# EAGLE design untitled (EAGLE 7.2.0)
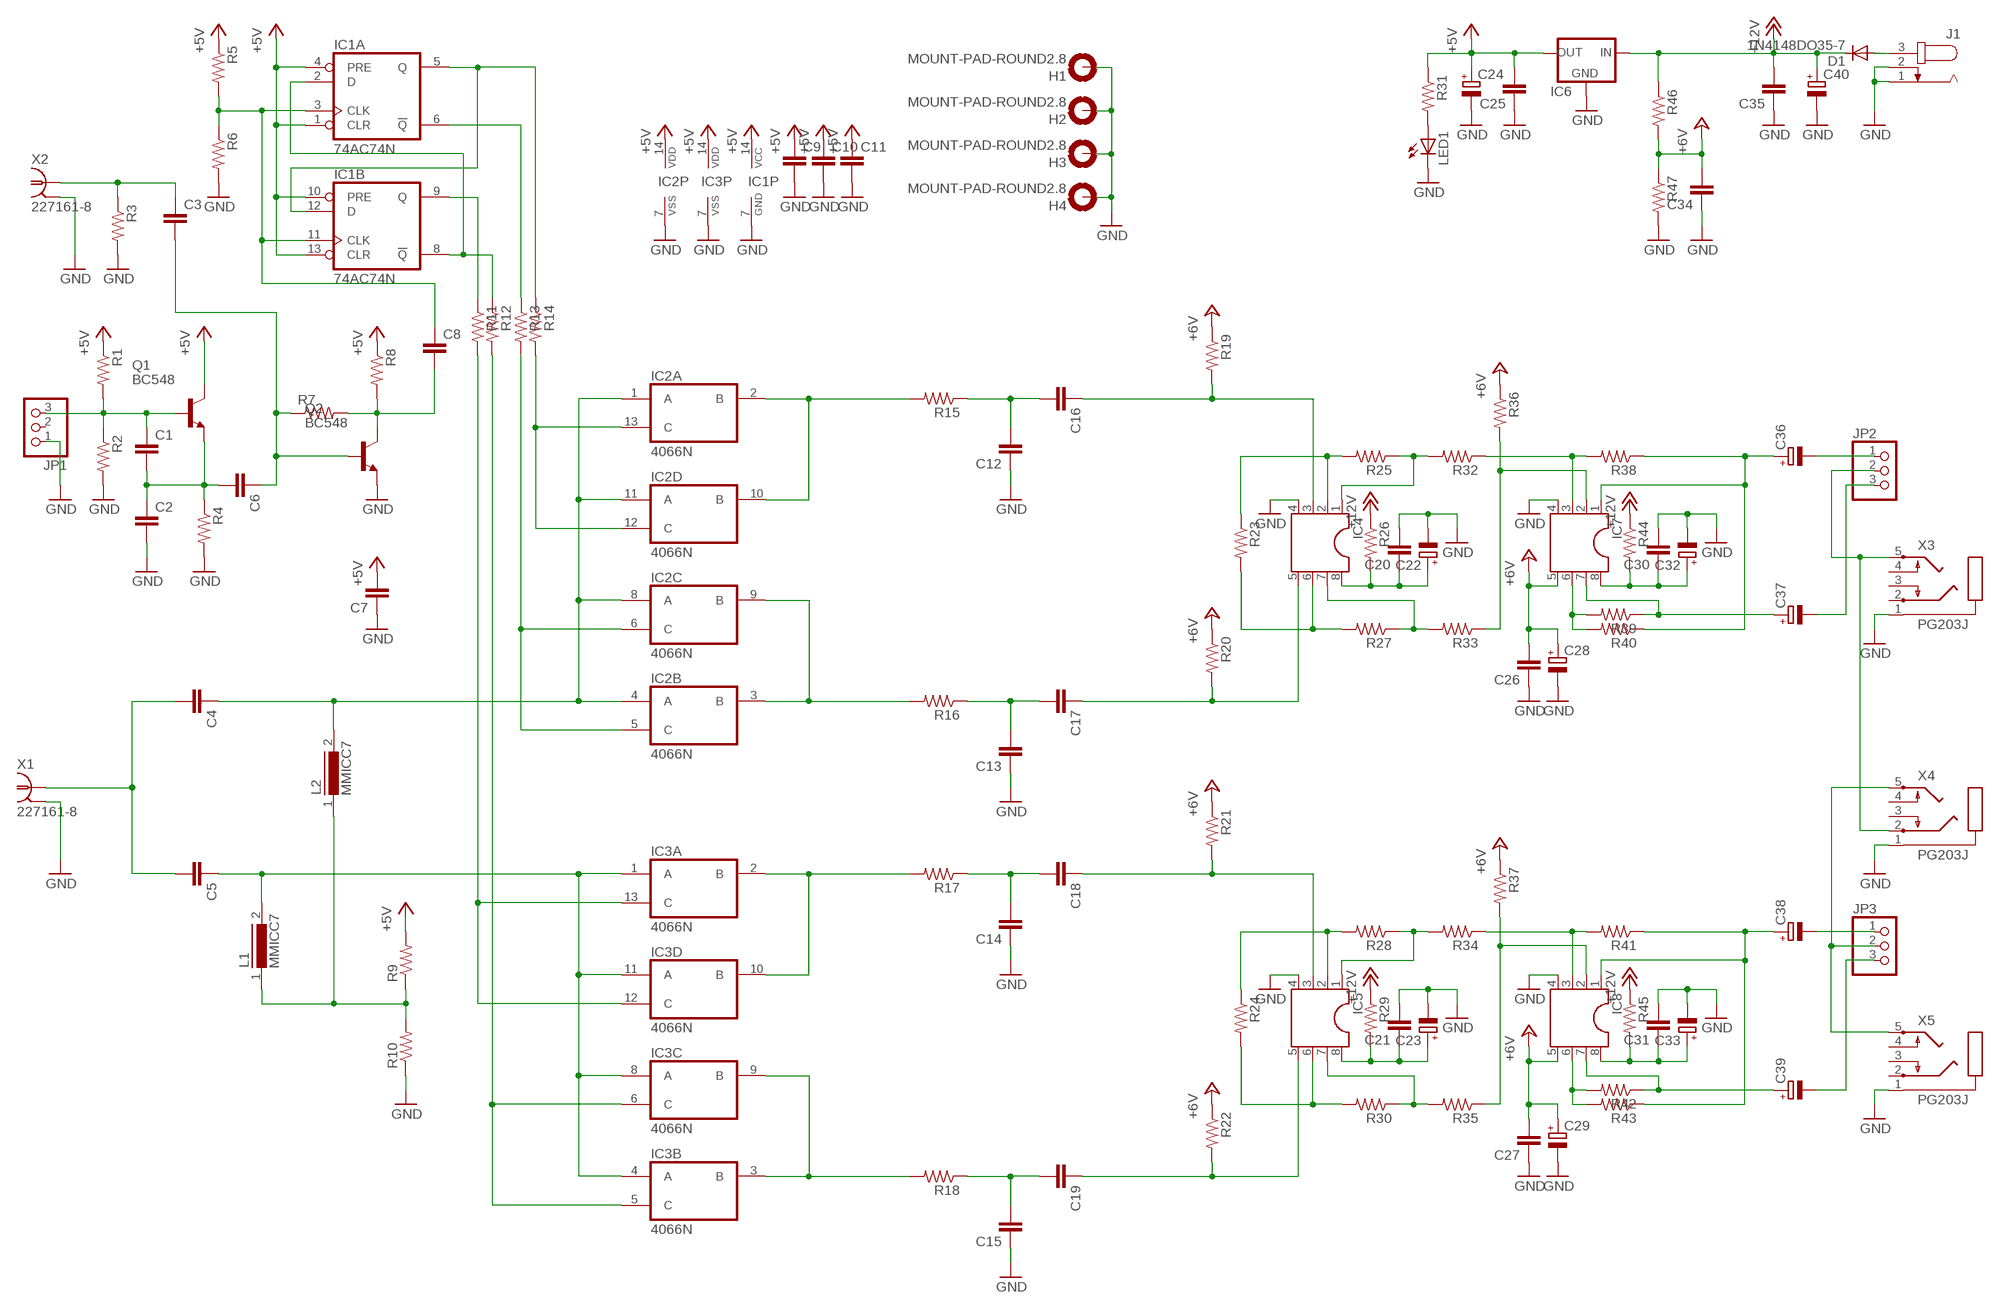
[diagram p0: schematic, sheet 1]

## Parts
C1  C-EU025-025X050  [C025-025X050]
C2  C-EU025-025X050  [C025-025X050]
C3  C-EU050-025X075  [C050-025X075]
C4  C-EU050-025X075  [C050-025X075]
C5  C-EU050-025X075  [C050-025X075]
C6  C-EU050-025X075  [C050-025X075]
C7  C-EU050-025X075  [C050-025X075]
C8  C-EU075-032X103  [C075-032X103]
C9  C-EU050-025X075  [C050-025X075]
C10  C-EU050-025X075  [C050-025X075]
C11  C-EU050-025X075  [C050-025X075]
C12  C-EU050-025X075  [C050-025X075]
C13  C-EU050-025X075  [C050-025X075]
C14  C-EU050-025X075  [C050-025X075]
C15  C-EU050-025X075  [C050-025X075]
C16  C-EU050-025X075  [C050-025X075]
C17  C-EU050-025X075  [C050-025X075]
C18  C-EU050-025X075  [C050-025X075]
C19  C-EU050-025X075  [C050-025X075]
C20  C-EU050-025X075  [C050-025X075]
C21  C-EU050-025X075  [C050-025X075]
C22  CPOL-EUE5-6  [E5-6]
C23  CPOL-EUE5-6  [E5-6]
C24  CPOL-EUE5-6  [E5-6]
C25  C-EU050-025X075  [C050-025X075]
C26  C-EU050-025X075  [C050-025X075]
C27  C-EU050-025X075  [C050-025X075]
C28  CPOL-EUE5-6  [E5-6]
C29  CPOL-EUE5-6  [E5-6]
C30  C-EU050-025X075  [C050-025X075]
C31  C-EU050-025X075  [C050-025X075]
C32  CPOL-EUE5-6  [E5-6]
C33  CPOL-EUE5-6  [E5-6]
C34  C-EU050-025X075  [C050-025X075]
C35  C-EU050-025X075  [C050-025X075]
C36  CPOL-EUE5-6  [E5-6]
C37  CPOL-EUE5-6  [E5-6]
C38  CPOL-EUE5-6  [E5-6]
C39  CPOL-EUE5-6  [E5-6]
C40  CPOL-EUE5-6  [E5-6]
D1  1N4148DO35-7  [DO35-7]
H1  MOUNT-PAD-ROUND2.8  [2,8-PAD]
H2  MOUNT-PAD-ROUND2.8  [2,8-PAD]
H3  MOUNT-PAD-ROUND2.8  [2,8-PAD]
H4  MOUNT-PAD-ROUND2.8  [2,8-PAD]
IC1  74AC74N  [DIL14]
IC2  4066N  [DIL14]
IC3  4066N  [DIL14]
IC4  DIL8  [DIL08]
IC5  DIL8  [DIL08]
IC6  78XXS  [78XXS]
IC7  DIL8  [DIL08]
IC8  DIL8  [DIL08]
J1  JACK-PLUG0  [SPC4077]
JP1  PINHD-1X3  [1X03]
JP2  PINHD-1X3  [1X03]
JP3  PINHD-1X3  [1X03]
L1  MMICC7  [MMICC7]
L2  MMICC7  [MMICC7]
LED1  LED3MM  [LED3MM]
Q1  BC548  [TO92-EBC]
Q2  BC548  [TO92-EBC]
R1  R-US_0207/7  [0207/7]
R2  R-US_0207/7  [0207/7]
R3  R-US_0207/7  [0207/7]
R4  R-US_0207/7  [0207/7]
R5  R-US_0207/7  [0207/7]
R6  R-US_0207/7  [0207/7]
R7  R-US_0207/7  [0207/7]
R8  R-US_0207/7  [0207/7]
R9  R-US_0207/7  [0207/7]
R10  R-US_0207/7  [0207/7]
R11  R-US_0207/7  [0207/7]
R12  R-US_0207/7  [0207/7]
R13  R-US_0207/7  [0207/7]
R14  R-US_0207/7  [0207/7]
R15  R-US_0207/7  [0207/7]
R16  R-US_0207/7  [0207/7]
R17  R-US_0207/7  [0207/7]
R18  R-US_0207/7  [0207/7]
R19  R-US_0207/7  [0207/7]
R20  R-US_0207/7  [0207/7]
R21  R-US_0207/7  [0207/7]
R22  R-US_0207/7  [0207/7]
R23  R-US_0207/7  [0207/7]
R24  R-US_0207/7  [0207/7]
R25  R-US_0207/7  [0207/7]
R26  R-US_0207/7  [0207/7]
R27  R-US_0207/7  [0207/7]
R28  R-US_0207/7  [0207/7]
R29  R-US_0207/7  [0207/7]
R30  R-US_0207/7  [0207/7]
R31  R-US_0207/7  [0207/7]
R32  R-US_0207/7  [0207/7]
R33  R-US_0207/7  [0207/7]
R34  R-US_0207/7  [0207/7]
R35  R-US_0207/7  [0207/7]
R36  R-US_0207/7  [0207/7]
R37  R-US_0207/7  [0207/7]
R38  R-US_0207/7  [0207/7]
R39  R-US_0207/7  [0207/7]
R40  R-US_0207/7  [0207/7]
R41  R-US_0207/7  [0207/7]
R42  R-US_0207/7  [0207/7]
R43  R-US_0207/7  [0207/7]
R44  R-US_0207/7  [0207/7]
R45  R-US_0207/7  [0207/7]
R46  R-US_0207/7  [0207/7]
R47  R-US_0207/7  [0207/7]
X1  227161-8  [AMP_227161]
X2  227161-8  [AMP_227161]
X3  PG203J  [PG203J]
X4  PG203J  [PG203J]
X5  PG203J  [PG203J]

## Nets
+5V: C7.2 C9.1 C10.1 C11.1 C24.+ C25.2 IC1.1(A:CLR) IC1.4(A:PRE) IC1.10(B:PRE) IC1.13(B:CLR) IC1.14(P:VCC) IC2.14(P:VDD) IC3.14(P:VDD) IC6.OUT Q1.C R1.1 R5.1 R8.1 R9.2 R31.1
+12V: C35.2 C40.+ D1.C IC6.IN R26.1 R29.1 R44.1 R45.1 R46.1
+24V: C26.2 C27.2 C28.+ C29.+ C34.2 IC7.5 IC8.5 R19.1 R20.1 R21.1 R22.1 R36.1 R37.1 R46.2 R47.1 ; supply symbol labelled +6V
GND: C2.2 C7.1 C9.2 C10.2 C11.2 C12.1 C13.1 C14.1 C15.1 C20.2 C21.2 C22.- C23.- C24.- C25.1 C26.1 C27.1 C28.- C29.- C30.2 C31.2 C32.- C33.- C34.1 C35.1 C40.- H1.B2,8(MOUNT) H2.B2,8(MOUNT) H3.B2,8(MOUNT) H4.B2,8(MOUNT) IC1.7(P:GND) IC2.7(P:VSS) IC3.7(P:VSS) IC4.4 IC5.4 IC6.GND IC7.4 IC8.4 J1.1 J1.2 JP1.1 LED1.K(C) Q2.E R2.2 R3.2 R4.2 R6.2 R10.1 R47.2 X1.2 X2.2 X3.1 X4.1 X5.1
N$1: L1.1 L2.1 R9.1 R10.2
N$2: C4.2 C5.2 X1.1
N$3: C4.1 IC2.1(A:A) IC2.4(B:A) IC2.8(C:A) IC2.11(D:A) L2.2
N$4: C5.1 IC3.1(A:A) IC3.4(B:A) IC3.8(C:A) IC3.11(D:A) L1.2
N$5: IC2.3(B:B) IC2.9(C:B) R16.2
N$6: IC2.2(A:B) IC2.10(D:B) R15.2
N$7: IC3.2(A:B) IC3.10(D:B) R17.2
N$8: IC3.3(B:B) IC3.9(C:B) R18.2
N$9: IC2.12(D:C) IC2.13(A:C) R14.2
N$10: IC2.5(B:C) IC2.6(C:C) R13.2
N$11: IC3.12(D:C) IC3.13(A:C) R11.2
N$12: IC3.5(B:C) IC3.6(C:C) R12.2
N$13: C12.2 C16.2 R15.1
N$14: C13.2 C17.2 R16.1
N$15: C14.2 C18.2 R17.1
N$16: C15.2 C19.2 R18.1
N$17: IC1.2(A:D) IC1.8(B:!Q) R12.1
N$18: IC1.6(A:!Q) R13.1
N$19: IC1.5(A:Q) IC1.12(B:D) R14.1
N$20: IC1.9(B:Q) R11.1
N$21: C8.1 IC1.3(A:CLK) IC1.11(B:CLK) R5.2 R6.1
N$22: C16.1 IC4.3 R19.2
N$23: C17.1 IC4.5 R20.2
N$24: IC4.2 R23.1 R25.2
N$25: IC4.6 R23.2 R27.2
N$26: IC4.7 R27.1 R33.2
N$27: IC4.1 R25.1 R32.2
N$28: IC7.2 R33.1 R36.2
N$29: C36.+ IC7.1 R38.1 R40.1
N$30: IC7.3 R32.1 R38.2
N$31: IC7.6 R39.2 R40.2
N$32: C37.+ IC7.7 R39.1
N$33: C20.1 C22.+ IC4.8 R26.2
N$34: C30.1 C32.+ IC7.8 R44.2
N$35: D1.A J1.3
N$36: C3.1 R3.1 X2.1
N$37: C36.- JP2.1
N$38: C18.1 IC5.3 R21.2
N$39: C19.1 IC5.5 R22.2
N$40: IC5.2 R24.1 R28.2
N$41: IC5.6 R24.2 R30.2
N$42: IC5.7 R30.1 R35.2
N$43: IC5.1 R28.1 R34.2
N$44: IC8.3 R34.1 R41.2
N$45: IC8.2 R35.1 R37.2
N$46: C38.+ IC8.1 R41.1 R43.1
N$47: IC8.6 R42.2 R43.2
N$48: C39.+ IC8.7 R42.1
N$49: C21.1 C23.+ IC5.8 R29.2
N$50: C31.1 C33.+ IC8.8 R45.2
N$51: C37.- JP2.3
N$52: C38.- JP3.1
N$53: C39.- JP3.3
N$54: C1.1 JP1.3 Q1.B R1.2 R2.1
N$55: C1.2 C2.1 C6.2 Q1.E R4.1
N$56: JP2.2 X3.5 X4.2
N$57: C8.2 Q2.C R7.2 R8.2
N$58: C3.2 C6.1 Q2.B R7.1
N$59: LED1.A R31.2
N$60: JP3.2 X4.5 X5.5
Unconnected: JP1.2 X3.2 X3.3 X3.4 X4.3 X4.4 X5.2 X5.3 X5.4

## Library data of the parts
C1-C21 C25-C27 C30 C31 C34 C35 = rcl:C-EU: CAPACITOR, European symbol
C22-C24 C28 C29 C32 C33 C36-C40 = rcl:CPOL-EU: POLARIZED CAPACITOR, European symbol
D1 = diode:1N4148: DIODE high speed (Philips)
H1-H4 = holes:MOUNT-PAD-ROUND: MOUNTING PAD, round
IC1 = 74xx-eu:74*74: Dual D type positive edge triggered FLIP FLOP, preset and clear
IC2 IC3 = 40xx:4066: Quad bilateral ANALOG SWITCH
IC4 IC5 IC7 IC8 = ic-package:DIL8: Dual In Line / Socket
IC6 = v-reg:78XXS: VOLTAGE REGULATOR
J1 = con-jack:JACK-PLUG: DC POWER JACK Power Jack, DC, Right Angle, Through Hole, Rated 5A at 16VDC, PC Terminals Distributor: Farnell (www.Farnell.de) Drawing: 84N1161.pdf / 84N1162.pdf Manufacturer: SPC Technology (www.spctechnology.com) Type: SPC4077 / SPC 4078; OC_FARNELL: unknown; OC_NEWARK: unknown
JP1-JP3 = pinhead:PINHD-1X3: PIN HEADER
L1 L2 = inductors:MMICC7: INDUCTOR
LED1 = led:LED: LED OSRAM: - CHIPLED LG R971, LG N971, LY N971, LG Q971, LY Q971, LO R971, LY R971 LH N974, LH R974 LS Q976, LO Q976, LY Q976 LO Q996 - Hyper CHIPLED LW Q18S LB Q993, LB Q99A, LB R99A - SideLED LS A670, LO A670, LY A670, LG A670, LP A670 LB A673, LV A673, LT A673, LW A673 LH A674 LY A675 LS A676, LA A676, LO A676, LY A676, LW A676 LS A679, LY A679, LG A679 - Hyper Micro SIDELED® LS Y876, LA Y876, LO Y876, LY Y876 LT Y87S - SmartLED LW L88C, LW L88S LB L89C, LB L89S, LG L890 LS L89K, LO L89K, LY L89K LS L896, LA L896, LO L896, LY L896 - TOPLED LS T670, LO T670, LY T670, LG T670, LP T670 LSG T670, LSP T670, LSY T670, LOP T670, LYG T670 LG T671, LOG T671, LSG T671 LB T673, LV T673, LT T673, LW T673 LH T674 LS T676, LA T676, LO T676, LY T676, LB T676, LH T676, LSB T676, LW T676 LB T67C, LV T67C, LT T67C, LS T67K, LO T67K, LY T67K, LW E67C LS E67B, LA E67B, LO E67B, LY E67B, LB E67C, LV E67C, LT E67C LW T67C LS T679, LY T679, LG T679 LS T770, LO T770, LY T770, LG T770, LP T770 LB T773, LV T773, LT T773, LW T773 LH T774 LS E675, LA E675, LY E675, LS T675 LS T776, LA T776, LO T776, LY T776, LB T776 LHGB T686 LT T68C, LB T68C - Hyper Mini TOPLED® LB M676 - Mini TOPLED Santana® LG M470 LS M47K, LO M47K, LY M47K Source: http://www.osram.convergy.de LUXEON: - LUMILED® LXK2-PW12-R00, LXK2-PW12-S00, LXK2-PW14-U00, LXK2-PW14-V00 LXK2-PM12-R00, LXK2-PM12-S00, LXK2-PM14-U00 LXK2-PE12-Q00, LXK2-PE12-R00, LXK2-PE12-S00, LXK2-PE14-T00, LXK2-PE14-U00 LXK2-PB12-K00, LXK2-PB12-L00, LXK2-PB12-M00, LXK2-PB14-N00, LXK2-PB14-P00, LXK2-PB14-Q00 LXK2-PR12-L00, LXK2-PR12-M00, LXK2-PR14-Q00, LXK2-PR14-R00 LXK2-PD12-Q00, LXK2-PD12-R00, LXK2-PD12-S00 LXK2-PH12-R00, LXK2-PH12-S00 LXK2-PL12-P00, LXK2-PL12-Q00, LXK2-PL12-R00 Source: www.luxeon.com KINGBRIGHT: KA-3528ASYC Source: www.kingbright.com
Q1 Q2 = transistor-npn:BC548*: NPN Transistor
R1-R47 = rcl:R-US_: RESISTOR, American symbol
X1 X2 = con-coax:?227161*: JACK, RIGHT ANGLE, 50 OHM, PCB, BNC Source: amp_227161.pdf; OC_FARNELL: unknown; OC_NEWARK: unknown
X3-X5 = con-hirschmann:PG203J: MIC/HEADPHONE JACK KS-S stereo microphone/headphone jack PG203JN (Schukat); OC_FARNELL: unknown; OC_NEWARK: unknown

## Board
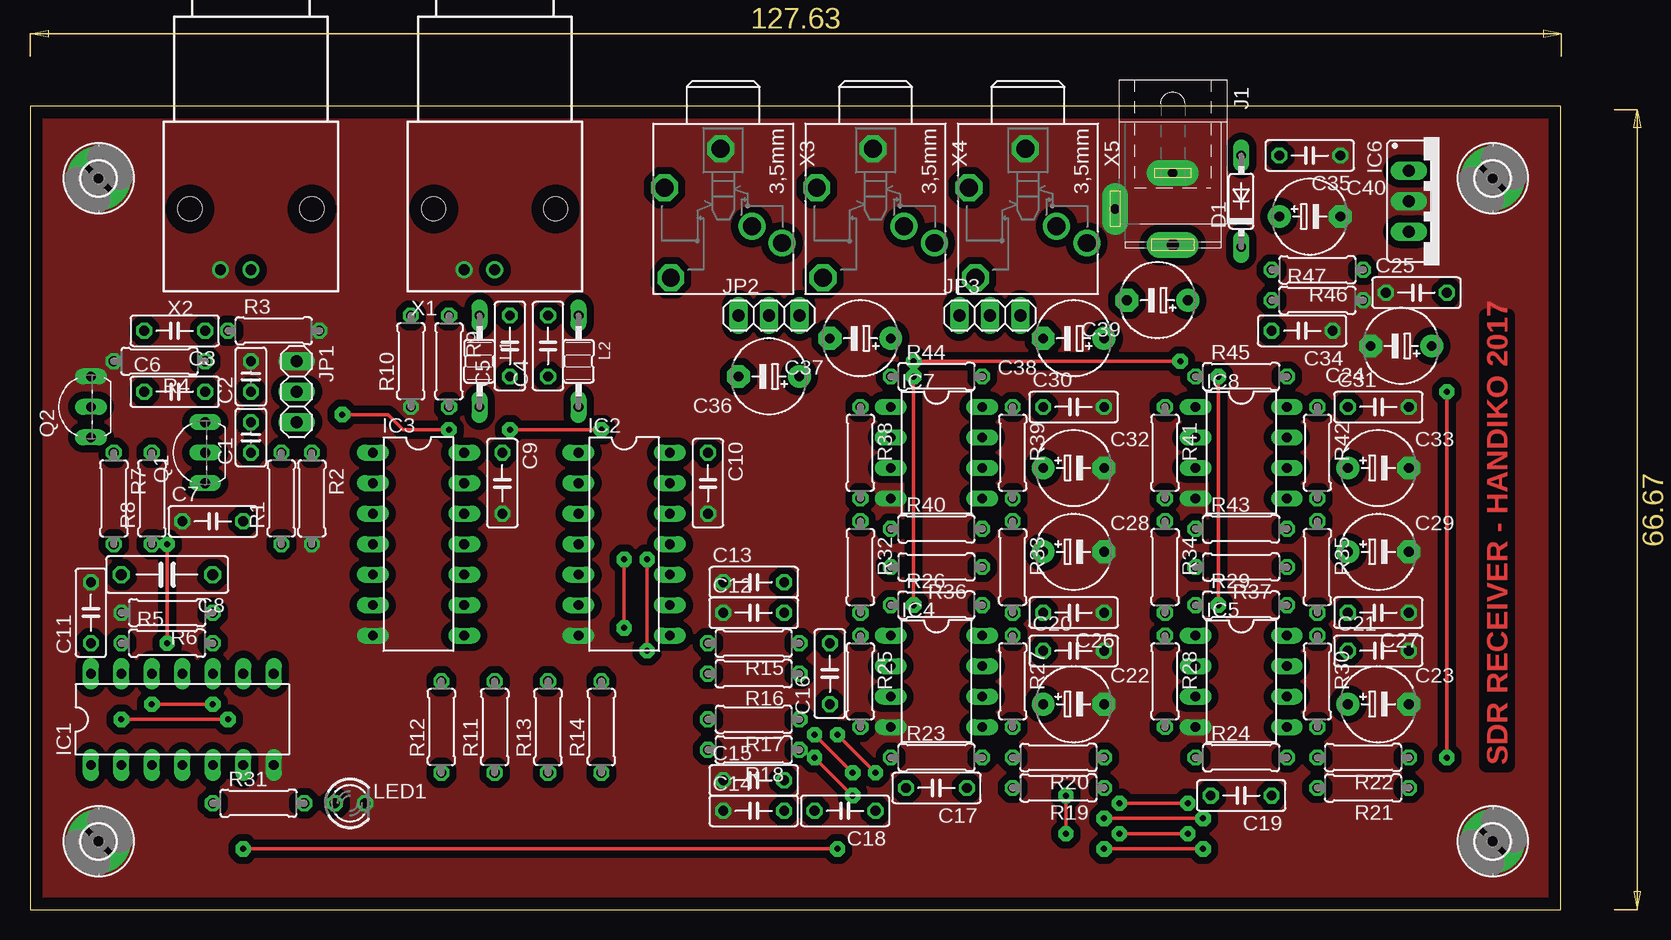
[diagram p1: board, top side]
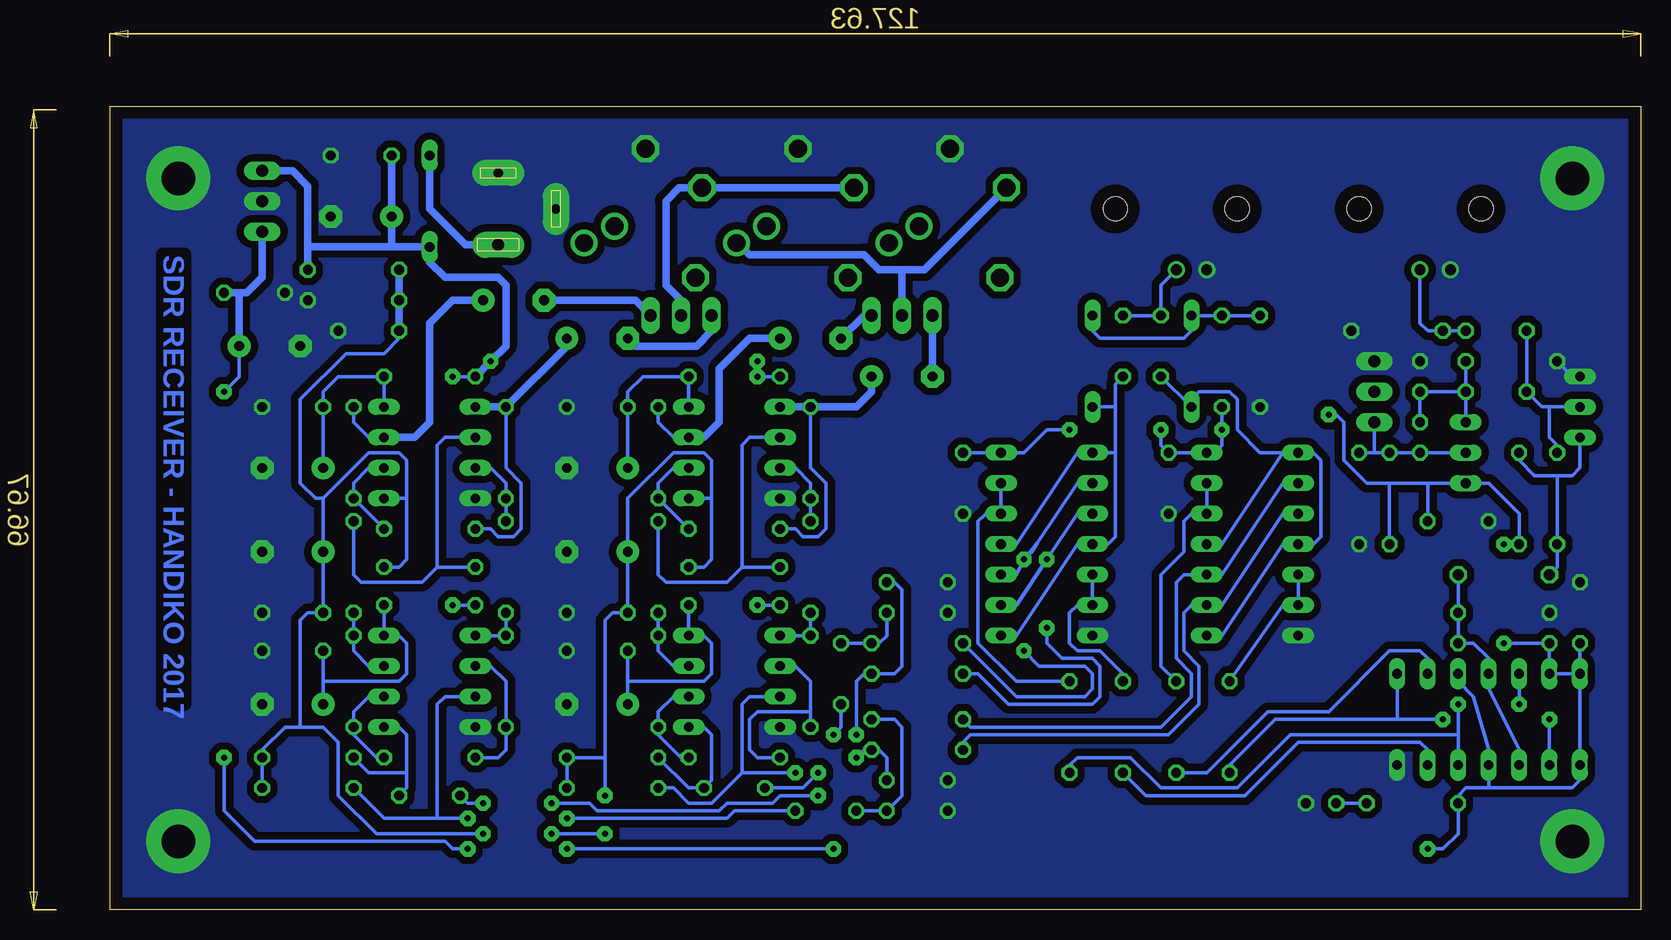
[diagram p2: board, bottom side, seen from below]

Size 127.62 x 66.98 mm. Coordinates in mm from the lower left corner, seen from the top.
Outline: 0,0 127.62,0 127.62,66.98 0,66.98 0,0
Copper layers (1*16): Top 0.035mm / dielectric 1.5mm / Bottom 0.035mm
Design rules "default": minimum track width 10mil, minimum drill 24mil, track to track 8mil, track to pad 8mil, pad to pad 8mil, via to via 8mil, smd to smd 8mil, copper to edge 40mil, drill to drill 8mil, minimum pad ring 10mil, minimum via ring 8mil, stop-mask expansion 4mil, vias tented up to drill 0mil, thermal gap 10mil

### Footprints (pad centres in the part's own frame; a part is rotated, then mirrored left to right if it is on the bottom)
C025-025X050 = drill 0.813 octagon: 1 -1.27,0; 2 1.27,0
C050-025X075 = drill 0.813 octagon: 1 -2.54,0; 2 2.54,0
C075-032X103 = drill 0.914 octagon: 1 -3.81,0; 2 3.81,0
E5-6 = drill 0.813 pad 1.905: + -2.54,0 | drill 0.813 pad 1.905 octagon: - 2.54,0
DO35-7 = drill 0.813 long: A 3.81,0; C -3.81,0
2,8-PAD = drill 2.8 pad 5.334: B2,8 0,0
DIL14 = drill 0.813 long: 1 -7.62,-3.81; 2 -5.08,-3.81; 3 -2.54,-3.81; 4 0,-3.81; 5 2.54,-3.81; 6 5.08,-3.81; 7 7.62,-3.81; 8 7.62,3.81; 9 5.08,3.81; 10 2.54,3.81; 11 0,3.81; 12 -2.54,3.81; 13 -5.08,3.81; 14 -7.62,3.81
DIL08 = drill 0.813 long: 1 -3.81,-3.81; 2 -1.27,-3.81; 3 1.27,-3.81; 4 3.81,-3.81; 5 3.81,3.81; 6 1.27,3.81; 7 -1.27,3.81; 8 -3.81,3.81
78XXS = drill 1.016 long: GND 0,-2.54; IN -2.54,-2.54; OUT 2.54,-2.54
SPC4077 = drill 0.8 pad 2.184 long: 1 -3,0; 2 0,-4.8 | drill 1 pad 2.184 long: 3 3,0
1X03 = drill 1.016 long: 1 -2.54,0; 2 0,0; 3 2.54,0
MMICC7 = drill 0.813 long: 1 -3.81,0; 2 3.81,0
LED3MM = drill 0.813 octagon: A -1.27,0; K 1.27,0
TO92-EBC = drill 0.813 long: B 0,-1.27; C -2.54,-1.27; E 2.54,-1.27
0207/7 = drill 0.813 octagon: 1 -3.81,0; 2 3.81,0
AMP_227161 = drill 0.9 pad 1.27: 1 0,-5.08; 2 -2.54,-5.08 | hole 2: -5.08,0; 5.08,0
PG203J = drill 1.499 octagon: 1 -5.004,-0.203; 4 5.74,-4.369; 5 -1.753,-4.902 | drill 1.499: 2 2.845,4.902; 3 1.448,2.388

### Placement (x,y rotation side)
C1  18.41,39.37 90 top
C2  18.41,44.45 90 top
C3  12.06,48.26 180 top
C4  43.18,46.99 90 top
C5  40.01,46.99 90 top
C6  12.06,43.18 0 top
C7  15.24,32.38 0 top
C8  11.43,27.94 180 top
C9  39.37,35.56 270 top
C10  56.52,35.56 270 top
C11  5.08,24.76 90 top
C12  60.32,24.76 0 top
C13  60.32,27.3 0 top
C14  60.32,8.25 0 top
C15  60.32,10.79 0 top
C16  66.67,19.68 90 top
C17  75.56,10.16 180 top
C18  67.94,8.25 180 top
C19  100.96,9.52 180 top
C20  86.99,21.59 0 top
C21  112.39,21.59 0 top
C22  86.99,17.14 0 top
C23  112.39,17.14 0 top
C24  114.3,46.99 180 top
C25  115.57,51.43 0 top
C26  86.99,24.76 180 top
C27  112.39,24.76 180 top
C28  86.99,29.84 0 top
C29  112.39,29.84 0 top
C30  86.99,41.91 0 top
C31  112.39,41.91 0 top
C32  86.99,36.83 0 top
C33  112.39,36.83 0 top
C34  106.05,48.26 180 top
C35  106.68,62.87 180 top
C36  61.6,44.45 180 top
C37  69.21,47.62 180 top
C38  86.99,47.62 180 top
C39  93.98,50.8 180 top
C40  106.68,57.79 0 top
D1  100.96,59.05 90 top
H1  5.72,60.96 0 top
H2  121.92,60.96 0 top
H3  5.72,5.71 0 top
H4  121.92,5.71 0 top
IC1  12.7,15.88 0 top
IC2  49.53,30.48 270 top
IC3  32.39,30.48 270 top
IC4  75.56,19.05 270 top
IC5  100.96,19.05 270 top
IC6  117.47,59.05 270 top
IC7  75.56,38.1 270 top
IC8  100.96,38.1 270 top
J1  95.25,58.42 270 top
JP1  22.22,43.18 270 top
JP2  61.6,49.53 0 top
JP3  80.01,49.53 0 top
L1  37.47,45.72 270 top
L2  45.72,45.72 270 top
LED1  26.67,8.89 0 top
Q1  13.33,38.1 90 top
Q2  3.81,41.91 90 top
R1  20.95,34.29 90 top
R2  23.49,34.29 270 top
R3  20.32,48.26 0 top
R4  10.79,45.72 180 top
R5  11.43,22.22 0 top
R6  11.43,24.76 180 top
R7  6.99,34.29 270 top
R8  10.16,34.29 90 top
R9  34.93,45.72 270 top
R10  31.75,45.72 90 top
R11  38.73,15.24 90 top
R12  34.29,15.24 90 top
R13  43.18,15.24 90 top
R14  47.62,15.24 90 top
R15  60.32,22.22 180 top
R16  60.32,19.68 180 top
R17  60.32,15.88 180 top
R18  60.32,13.33 180 top
R19  85.72,10.16 180 top
R20  85.72,12.7 180 top
R21  111.12,10.16 180 top
R22  111.12,12.7 180 top
R23  75.56,12.7 0 top
R24  100.96,12.7 0 top
R25  69.21,19.05 270 top
R26  75.56,25.4 0 top
R27  81.91,19.05 270 top
R28  94.61,19.05 270 top
R29  100.96,25.4 0 top
R30  107.31,19.05 270 top
R31  19.05,8.89 0 top
R32  69.21,28.57 270 top
R33  81.91,28.57 270 top
R34  94.61,28.57 270 top
R35  107.31,28.57 270 top
R36  75.56,28.57 180 top
R37  100.96,28.57 180 top
R38  69.21,38.1 270 top
R39  81.91,38.1 270 top
R40  75.56,31.75 0 top
R41  94.61,38.1 270 top
R42  107.31,38.1 270 top
R43  100.96,31.75 0 top
R44  75.56,44.45 0 top
R45  100.96,44.45 0 top
R46  107.31,53.34 180 top
R47  107.31,50.8 0 top
X1  38.73,58.42 0 top
X2  18.41,58.42 0 top
X3  57.79,58.42 270 top
X4  70.48,58.42 270 top
X5  83.19,58.42 270 top

### Tracks (layer width: path | path; a pad name or v marks a point on that pad's centre or on a via)
+5V  (via drill 0.5 pad 1.27)
  Top 0.305: v40.01,40.01 v47.62,40.01 | v34.93,40.01 31.11,40.01 29.85,41.27 v26.04,41.27 | v11.43,22.22 v11.43,30.48 | v118.11,43.18 v118.11,12.7 | v67.31,5.08 v17.78,5.08 | v89.53,5.08 v97.79,5.08
  Bottom 0.305: C10.1 IC2.14 51.44,38.1 49.53,40.01 v47.62,40.01 | 17.78,35.56 Q1.C 12.7,35.56 10.16,33.02 R8.1 v11.43,30.48 | 17.78,35.56 20.95,35.56 | 20.95,35.56 22.86,35.56 24.76,37.46 24.76,40.64 25.4,41.27 v26.04,41.27 | 20.95,35.56 R1.1 | C7.2 17.78,35.56 | IC1.14 C11.1 | IC1.10 15.24,19.05 13.97,17.78 12.7,13.33 IC1.4 12.7,10.16 | IC1.14 IC1.13 R5.1 v11.43,22.22 | IC1.14 IC1.1 5.08,10.79 5.72,10.16 12.7,10.16 | 12.7,10.16 14.61,10.16 15.24,9.52 R31.1 15.24,6.35 16.51,5.08 v17.78,5.08 | R9.2 v34.93,40.01 34.93,38.73 35.56,38.1 IC3.14 C9.1 40.01,38.73 v40.01,40.01 | C24.+ 116.84,44.45 v118.11,43.18 | v118.11,12.7 118.11,8.25 115.57,5.71 99.69,5.71 99.06,5.08 v97.79,5.08 | v89.53,5.08 v67.31,5.08
  Bottom 0.61: IC6.OUT 114.94,52.7 116.2,51.43 116.84,51.43 | 116.84,51.43 C25.2 | C24.+ 116.84,51.43
+12V  (via drill 0.5 pad 1.27)
  Top 0.305: v73.66,45.72 v95.88,45.72 | v99.06,44.45 v99.06,25.4 | v73.66,44.45 v73.66,25.4
  Bottom 0.305: v73.66,45.72 v73.66,44.45 R44.1 | R45.1 v99.06,44.45 | v99.06,25.4 R29.1 | v73.66,25.4 R26.1
  Bottom 0.61: C35.2 C40.+ 104.14,55.24 | 104.14,55.24 D1.C 100.96,53.98 99.69,52.7 95.25,52.7 94.61,52.07 94.61,46.99 v95.88,45.72 R45.1 | 104.14,55.24 111.12,55.24 | 111.12,55.24 111.12,60.32 112.39,61.59 IC6.IN | R46.1 111.12,55.24
+24V  (via drill 0.5 pad 1.27)
  Top 0.305: v86.36,9.52 v86.36,6.35 | v96.52,6.35 v90.8,6.35
  Bottom 0.305: R36.1 78.1,28.57 77.47,29.21 77.47,34.29 | 77.47,34.29 IC7.5 | 77.47,34.29 77.47,37.46 78.1,38.1 80.64,38.1 84.45,34.29 C28.+ C26.2 85.72,24.76 86.36,24.13 86.36,12.7 | R37.1 103.5,28.57 102.87,29.21 102.87,34.29 | 102.87,34.29 IC8.5 | 109.85,34.29 C29.+ C27.2 111.12,24.76 111.76,24.13 111.76,15.24 | 109.85,34.29 106.05,38.1 103.5,38.1 102.87,37.46 102.87,34.29 | 111.76,15.24 113.03,15.24 114.94,13.33 R22.1 R21.1 | 86.36,12.7 R20.1 R19.1 | C34.2 103.5,47.62 104.77,46.35 107.95,46.35 111.76,42.54 111.76,35.56 110.49,34.29 109.85,34.29 | 86.36,12.7 v86.36,9.52 | 111.76,15.24 109.85,15.24 108.58,13.97 108.58,9.52 105.41,6.35 v96.52,6.35 | v90.8,6.35 v86.36,6.35
  Bottom 0.61: R46.2 R47.1 C34.2
GND
  Bottom 0.305: Q2.E 5.72,44.45 R4.2
  pour Bottom (isolate 0.61, no thermals): 0,66.67 127.63,66.67 127.63,0 0,0
  pour Top (isolate 0.61, no thermals): 0,66.67 127.63,66.67 127.63,0 0,0
N$1
  Bottom 0.305: R10.2 R9.1 L1.1 37.47,48.26 38.1,47.62 45.09,47.62 45.72,48.26 L2.1
N$2
  Bottom 0.305: C4.2 C5.2 40.01,52.07 X1.1
N$3
  Bottom 0.305: C4.1 43.82,43.81 43.82,41.91 | IC2.11 52.07,30.48 46.99,38.1 IC2.1 43.82,38.1 | IC2.8 52.07,22.86 46.99,30.48 IC2.4 44.45,30.48 43.82,31.12 43.82,38.1 | L2.2 43.82,41.91 | 43.82,41.91 43.82,38.1
N$4
  Bottom 0.305: C5.1 L1.2 37.47,42.54 36.83,43.18 34.29,43.18 33.66,42.54 33.66,40.01 31.75,38.1 29.85,38.1 | IC3.8 34.93,22.86 29.85,30.48 IC3.4 27.3,30.48 26.67,31.12 26.67,37.46 27.3,38.1 IC3.1 29.85,38.1 | IC3.11 34.93,30.48 29.85,38.1
N$5  (via drill 0.5 pad 1.27)
  Top 0.305: v49.53,23.49 v49.53,29.21
  Bottom 0.305: IC2.3 46.99,33.02 v49.53,29.21 52.07,25.4 IC2.9 | R16.2 55.25,19.68 52.71,17.14 45.72,17.14 45.09,17.78 45.09,20.32 45.72,20.95 48.26,20.95 49.53,22.22 v49.53,23.49
N$6  (via drill 0.5 pad 1.27)
  Top 0.305: v51.44,21.59 v51.44,29.21
  Bottom 0.305: IC2.2 46.99,35.56 50.31,30.58 | 50.31,30.58 v51.44,29.21 | v51.44,29.21 52.07,27.94 IC2.10 | R15.2 52.07,17.78 46.36,17.78 45.72,18.41 45.72,19.68 46.36,20.32 50.16,20.32 v51.44,21.59 | v51.44,29.21 50.8,29.8 50.31,30.58
N$7
  Bottom 0.305: IC3.2 29.85,35.56 34.93,27.94 IC3.10 38.1,27.94 38.73,27.3 38.73,20.95 37.47,19.68 37.47,17.78 40.01,15.24 55.88,15.24 R17.2
N$8
  Bottom 0.305: IC3.3 29.85,33.02 34.93,25.4 IC3.9 37.47,25.4 38.1,24.76 38.1,21.59 36.83,20.32 36.83,17.14 39.37,14.6 55.88,14.6 56.52,13.97 R18.2
N$9
  Bottom 0.305: IC2.13 IC2.12 54.61,33.02 55.25,32.38 55.25,22.22 52.07,19.05 R14.2
N$10
  Bottom 0.305: IC2.5 IC2.6 46.99,25.4 47.62,24.76 47.62,22.22 46.99,21.59 45.09,21.59 43.18,19.68 R13.2
N$11
  Bottom 0.305: IC3.13 IC3.12 37.47,33.02 38.1,32.38 38.1,29.84 40.01,27.94 40.01,20.32 R11.2
N$12
  Bottom 0.305: IC3.5 IC3.6 29.85,25.4 R12.2
N$13
  Bottom 0.305: C12.2 62.87,22.86 63.5,22.22 R15.1 C16.2
N$14  (via drill 0.5 pad 1.27)
  Top 0.305: v65.41,14.6 v68.58,11.43
  Bottom 0.305: C13.2 62.23,27.3 61.6,26.67 61.6,20.32 62.23,19.68 R16.1 64.77,19.68 65.41,19.05 v65.41,14.6 | v68.58,11.43 69.85,10.16 C17.2
N$15
  Bottom 0.305: C18.2 C14.2 61.6,9.52 61.6,15.24 62.23,15.88 R17.1
N$16  (via drill 0.5 pad 1.27)
  Top 0.305: v65.41,12.7 v68.58,9.52 | v90.8,8.89 v96.52,8.89
  Bottom 0.305: C15.2 62.87,12.7 63.5,13.33 R18.1 64.77,13.33 v65.41,12.7 | v68.58,9.52 71.75,9.52 72.39,8.89 76.2,8.89 76.83,8.25 86.99,8.25 87.63,8.89 v90.8,8.89 | C19.2 97.79,8.89 v96.52,8.89
N$17  (via drill 0.5 pad 1.27)
  Top 0.305: v7.62,15.88 v16.51,15.88
  Bottom 0.305: IC1.2 v7.62,15.88 | v16.51,15.88 20.32,15.88 | 20.32,15.88 IC1.8 | R12.1 34.29,12.06 30.48,15.88 20.32,15.88
N$18
  Bottom 0.305: IC1.6 17.78,13.33 18.41,13.97 28.57,13.97 33.02,9.52 41.28,9.52 R13.1
N$19  (via drill 0.5 pad 1.27)
  Top 0.305: v10.16,17.14 v15.24,17.14
  Bottom 0.305: IC1.12 v10.16,17.14 | v15.24,17.14 15.24,14.6 | 15.24,14.6 IC1.5 | R14.1 47.62,12.06 46.99,12.7 42.55,12.7 40.01,10.16 33.66,10.16 29.21,14.6 15.24,14.6
N$20
  Bottom 0.305: R11.1 36.2,11.43 31.11,16.51 26.04,16.51 20.95,21.59 18.41,21.59 17.78,20.95 IC1.9
N$21
  Bottom 0.305: C8.1 R6.1 R5.2 13.97,22.22 12.7,20.95 IC1.11 12.7,18.41 10.16,13.33 IC1.3
N$22  (via drill 0.5 pad 1.27)
  Top 0.305: v67.31,14.6 v70.48,11.43
  Bottom 0.305: C16.1 66.67,15.24 v67.31,14.6 | v70.48,11.43 74.93,11.43 | 74.93,11.43 74.93,17.14 74.3,17.78 IC4.3 | R19.2 80.64,10.16 79.38,8.89 77.47,8.89 74.93,11.43
N$23
  Bottom 0.305: IC4.5 78.1,15.24 77.47,14.6 77.47,10.79 C17.1 79.38,10.16 R20.2
N$24
  Bottom 0.305: R25.2 69.21,16.51 | 69.21,16.51 69.21,19.05 70.48,20.32 IC4.2 | R23.1 73.66,12.7 74.3,13.33 74.3,15.88 73.66,16.51 69.21,16.51
N$25
  Bottom 0.305: R23.2 80.01,12.7 81.91,14.6 R27.2 81.91,16.51 80.64,17.78 IC4.6
N$26
  Bottom 0.305: IC4.7 80.64,20.32 81.91,21.59 R27.1 R33.2
N$27
  Bottom 0.305: IC4.1 R25.1 R32.2
N$28
  Bottom 0.305: R33.1 81.91,27.94 81.28,27.3 76.2,27.3 74.93,28.57 | 74.93,28.57 74.93,38.73 74.3,39.37 IC7.2 | R36.2 74.93,28.57
N$29
  Bottom 0.305: R40.1 70.48,31.75 69.85,31.12 68.58,31.12 67.94,31.75 67.94,35.56 69.21,36.83 R38.1
  Bottom 0.61: C36.+ 64.13,43.18 65.41,41.91 R38.1 IC7.1
N$30
  Bottom 0.305: R32.1 R38.2 69.21,35.56 70.48,36.83 IC7.3
N$31
  Bottom 0.305: R40.2 R39.2 81.91,35.56 80.64,36.83 IC7.6
N$32
  Bottom 0.305: IC7.7 80.64,39.37 81.91,40.64 R39.1
  Bottom 0.61: C37.+ 74.3,47.62 76.83,45.09 76.83,40.64 78.1,39.37 IC7.7
N$33
  Bottom 0.305: R26.2 IC4.8 78.1,22.86 77.47,22.22 77.47,19.68 78.1,19.05 84.45,19.05 | 84.45,19.05 C22.+ | C20.1 84.45,19.05
N$34
  Bottom 0.305: IC7.8 R44.2 83.19,44.45 84.45,43.18 C30.1 C32.+
N$35
  Bottom 0.61: J1.3 97.96,55.42 100.96,58.42 D1.A
N$36
  Bottom 0.305: C3.1 R3.1 17.78,48.26 18.41,48.9 X2.1
N$37
  Bottom 0.61: JP2.1 C36.-
N$38  (via drill 0.5 pad 1.27)
  Top 0.305: v97.79,7.62 v89.53,7.62
  Bottom 0.305: C18.1 75.56,8.25 76.2,7.62 v89.53,7.62 | 100.33,7.62 100.33,17.14 99.69,17.78 IC5.3 | R21.2 104.77,7.62 100.33,7.62 | 100.33,7.62 v97.79,7.62
N$39
  Bottom 0.305: IC5.5 103.5,15.24 102.87,14.6 102.87,11.43 | 102.87,11.43 102.87,10.16 C19.1 | R22.2 106.05,11.43 102.87,11.43
N$40
  Bottom 0.305: IC5.2 95.88,20.32 94.61,19.05 R28.2 94.61,13.33 95.25,12.7 R24.1
N$41
  Bottom 0.305: IC5.6 106.05,17.78 107.31,16.51 R30.2 107.31,14.6 105.41,12.7 R24.2
N$42
  Bottom 0.305: IC5.7 106.05,20.32 107.31,21.59 R30.1 R35.2
N$43
  Bottom 0.305: R34.2 R28.1 IC5.1
N$44
  Bottom 0.305: R34.1 R41.2 94.61,35.56 95.88,36.83 IC8.3
N$45
  Bottom 0.305: R35.1 107.31,27.94 106.68,27.3 101.6,27.3 100.33,28.57 | 100.33,28.57 R37.2 | IC8.2 99.69,39.37 100.33,38.73 100.33,28.57
N$46
  Bottom 0.305: R43.1 95.88,31.75 95.25,31.12 93.98,31.12 93.34,31.75 93.34,35.56 94.61,36.83 R41.1
  Bottom 0.61: C38.+ 89.53,46.99 R41.1 IC8.1
N$47
  Bottom 0.305: R43.2 R42.2 107.31,35.56 106.05,36.83 IC8.6
N$48
  Bottom 0.305: IC8.7 106.05,39.37 107.31,40.64 R42.1
  Bottom 0.61: C39.+ 99.06,50.8 100.96,48.9 100.96,40.64 102.23,39.37 IC8.7
N$49
  Bottom 0.305: R29.2 IC5.8 103.5,22.86 102.87,22.22 102.87,19.68 103.5,19.05 109.85,19.05 | C23.+ 109.85,19.05 | 109.85,19.05 C21.1
N$50
  Bottom 0.305: IC8.8 R45.2 108.58,44.45 109.85,43.18 C31.1 C33.+
N$51
  Bottom 0.61: JP2.3 64.77,49.53 C37.-
N$52
  Bottom 0.61: JP3.1 77.47,48.26 78.74,46.99 83.82,46.99 C38.-
N$53
  Bottom 0.61: JP3.3 83.82,50.8 C39.-
N$54
  Bottom 0.305: Q1.B C1.1 R1.2 22.22,38.1 | 22.22,38.1 R2.1 | JP1.3 22.22,38.1
N$55
  Bottom 0.305: Q1.E C6.2 | C6.2 R4.1 | C6.2 C2.1 C1.2
N$56
  Bottom 0.61: X4.2 75.26,55.57 74.3,54.61 64.77,54.61 63.5,53.34 61.6,53.34 | 61.6,53.34 59.71,53.34 X3.5 | JP2.2 61.6,53.34
N$57
  Bottom 0.305: Q2.C 5.08,36.83 5.72,36.2 6.99,36.2 | 6.99,36.2 8.89,36.2 10.16,37.46 R8.2 | 6.99,36.2 R7.2 6.99,28.57 C8.2
N$58
  Bottom 0.305: C3.2 C6.1 8.25,41.91 7.62,41.91 | Q2.B 7.62,41.91 | R7.1 6.99,38.73 7.62,39.37 7.62,41.91
N$59
  Bottom 0.305: R31.2 LED1.A
N$60
  Bottom 0.61: JP3.2 80.01,50.8 81.28,52.07 81.28,59.05 80.16,60.17 X5.5 X4.5

### Text on the board
Top: SDR RECEIVER - HANDIKO 2017
Bottom: SDR RECEIVER - HANDIKO 2017